# Altium schematic sheet Mounting_Holes.SchDoc
size A4; SheetNumber: 1; SheetTotal: 1
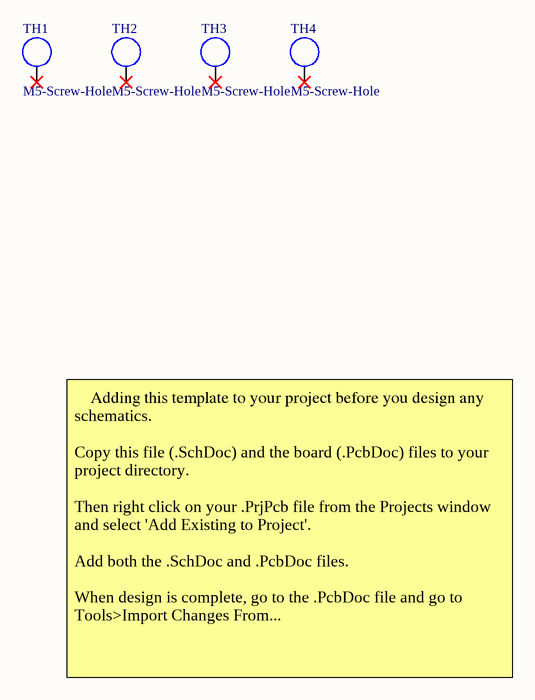
[diagram p0: Mounting_Holes.SchDoc]

## Parts
TH1  M5-Screw-Hole  [M5_Screw_Hole]
TH2  M5-Screw-Hole  [M5_Screw_Hole]
TH3  M5-Screw-Hole  [M5_Screw_Hole]
TH4  M5-Screw-Hole  [M5_Screw_Hole]

## Nets

Not connected (* = marked no-connect by the designer): TH1 1*; TH2 1*; TH3 1*; TH4 1*

## Notes on the sheet
- Adding this template to your project before you design any schematics.
  Copy this file (.SchDoc) and the board (.PcbDoc) files to your project directory.
  Then right click on your .PrjPcb file from the Projects window and select 'Add Existing to Project'.
  Add both the .SchDoc and .PcbDoc files.
  When design is complete, go to the .PcbDoc file and go to Tools>Import Changes From...